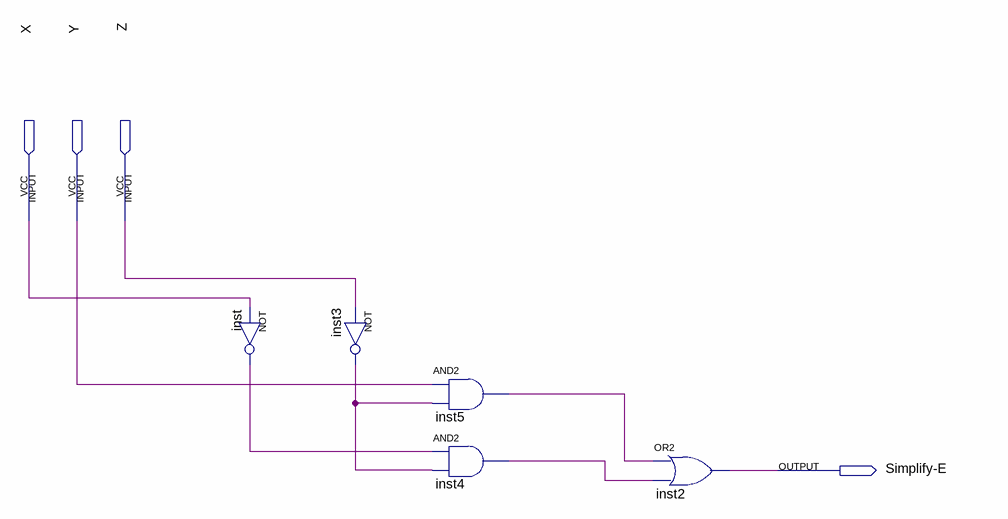
[diagram p0: schematic sheet]
// Quartus schematic Simplify-E.bdf as structural Verilog: 5 symbols, 4 pins
module \Simplify-E  (
  input  X,
  input  Y,
  input  Z,
  output \Simplify-E 
);

  wire inst3_out, inst4_out, inst5_out, inst_out;

  not inst (inst_out, X);
  not inst3 (inst3_out, Z);
  and inst5 (inst5_out, Y, inst3_out);
  and inst4 (inst4_out, inst_out, inst3_out);
  or inst2 (\Simplify-E , inst5_out, inst4_out);
endmodule
